# EAGLE schematic NE556-CD4069-Synth-Toy-2 (EAGLE 7.2.0)
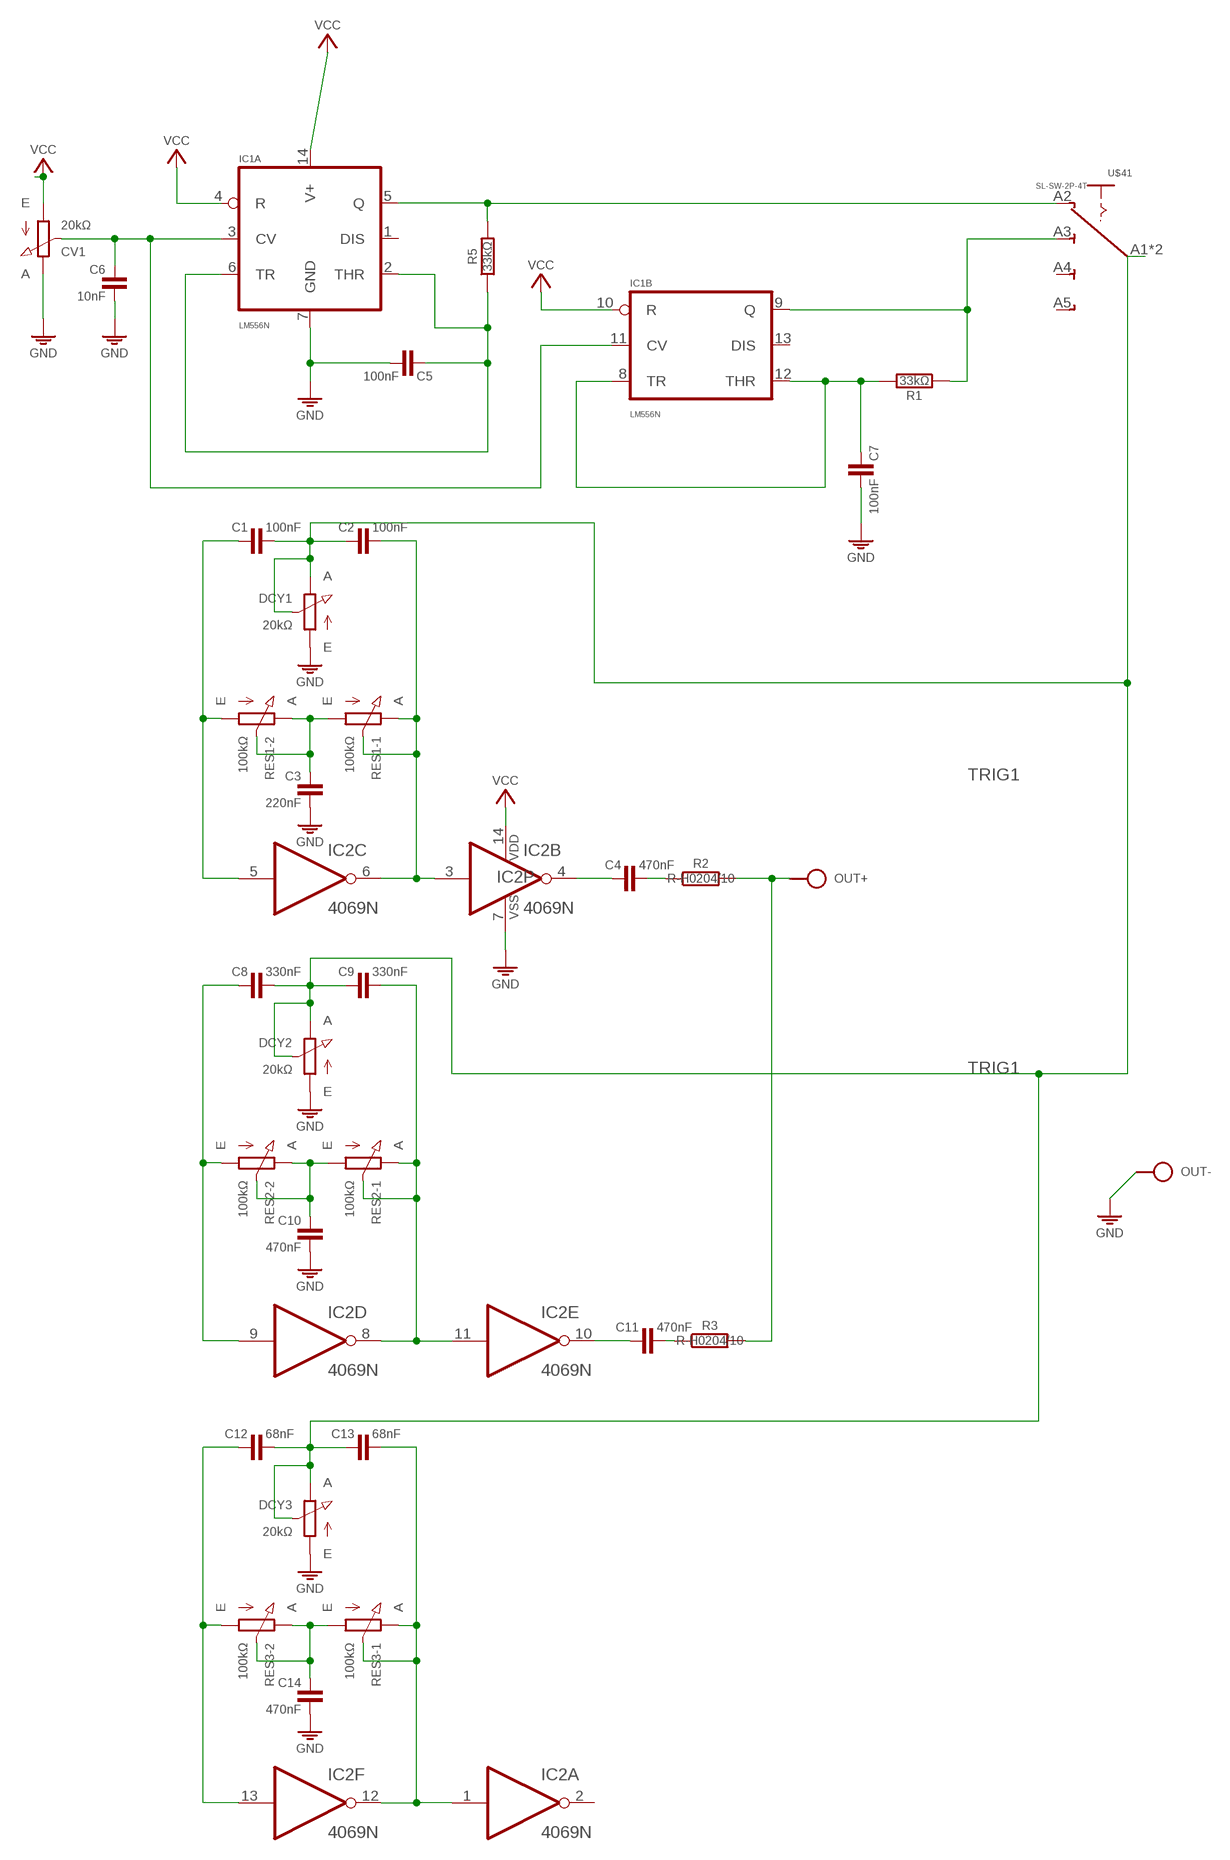
[diagram p0: schematic, sheet 1]

## Parts
C1  100nF  C-H050-024X044  [C050-024X044]
C2  100nF  C-H050-024X044  [C050-024X044]
C3  220nF  C050-020X044/V  [C050-020X044/V]
C4  470nF  C-H050-024X044  [C050-024X044]
C5  100nF  C-H050-020X044  [C050-020X044]
C6  10nF  C050-020X044/V  [C050-020X044/V]
C7  100nF  C-H050-020X044  [C050-020X044]
C8  330nF  C-H050-024X044  [C050-024X044]
C9  330nF  C-H050-024X044  [C050-024X044]
C10  470nF  C050-020X044/V  [C050-020X044/V]
C11  470nF  C-H050-024X044  [C050-024X044]
C12  68nF  C-H050-024X044  [C050-024X044]
C13  68nF  C-H050-024X044  [C050-024X044]
C14  470nF  C050-020X044/V  [C050-020X044/V]
CV1  20kΩ  POT  [POT]
DCY1  20kΩ  POT  [POT]
DCY2  20kΩ  POT  [POT]
DCY3  20kΩ  POT  [POT]
IC1  LM556N  [DIL14]
IC2  4069N  [DIL14]
OUT  SPAD+-+-  [SPAD+-]
R1  33kΩ  R-H0204/10-V  [0204/10-V]
R2  R-H0204/10  [0204/10]
R3  R-H0204/10  [0204/10]
R5  33kΩ  R-H0204/10-V  [0204/10-V]
RES1  100kΩ  POT-STEREO  [POT-STEREO-2X3]
RES2  100kΩ  POT-STEREO  [POT-STEREO-2X3]
RES3  100kΩ  POT-STEREO-1X6-V  [POT-STEREO-1X6-V]
S3  VCC_GNDPWR-L  [PWR-L]
U$4  SL-SW-2P-4T  [SLSW-2P4T-2-H]

## Nets
GND: C3.2 C5.2 C6.2 C7.2 C10.2 C14.2 CV1.E DCY1.A DCY2.A DCY3.A IC1.7(A:GND) IC2.7(P:VSS) OUT.1 S3.1
N$1: C2.2 IC2.3(B:I) IC2.6(C:O) RES1.1-E(-1:E) RES1.1-S(-1:S)
N$2: IC1.5(A:Q) R5.2 U$4.A2(1:A)
N$3: C4.2 R2.1
N$4: C3.1 RES1.1-A(-1:A) RES1.2-E(-2:E) RES1.2-S(-2:S)
N$5: C14.1 RES3.1A(-1:A) RES3.2E(-2:E) RES3.2S(-2:S)
N$6: C4.1 IC2.4(B:O)
N$7: C1.1 IC2.5(C:I) RES1.2-A(-2:A)
N$8: C5.1 IC1.2(A:THR) IC1.6(A:TR) R5.1
N$9: C6.1 CV1.S IC1.3(A:CV) IC1.11(B:CV)
N$10: C12.1 IC2.13(F:I) RES3.2A(-2:A)
N$11: IC1.9(B:Q) R1.1 U$4.A3(1:B)
N$12: C7.1 IC1.8(B:TR) IC1.12(B:THR) R1.2
N$13: C10.1 RES2.1-A(-1:A) RES2.2-E(-2:E) RES2.2-S(-2:S)
N$14: C8.1 IC2.9(D:I) RES2.2-A(-2:A)
N$15: C13.2 IC2.1(A:I) IC2.12(F:O) RES3.1E(-1:E) RES3.1S(-1:S)
N$17: C11.2 R3.1
N$18: C11.1 IC2.10(E:O)
N$19: OUT.2 R2.2 R3.2
N$20: C9.2 IC2.8(D:O) IC2.11(E:I) RES2.1-E(-1:E) RES2.1-S(-1:S)
TRIG1: C1.2 C2.1 C8.2 C9.1 C12.2 C13.1 DCY1.E DCY1.S DCY2.E DCY2.S DCY3.E DCY3.S U$4.A1(1:P) U$4.A6(1:P)
VCC: CV1.A IC1.4(A:R) IC1.10(B:R) IC1.14(A:V+) IC2.14(P:VDD) S3.2
Unconnected: IC1.1(A:DIS) IC1.13(B:DIS) IC2.2(A:O) U$4.A4(1:C) U$4.A5(1:D) U$4.B1(2:P) U$4.B2(2:A) U$4.B3(2:B) U$4.B4(2:C) U$4.B5(2:D) U$4.B6(2:P)

## Library data of the parts
C1 C2 C4 C5 C7-C9 C11-C13 = c:C-H
C3 C6 C10 C14 = c:C: CAPACITOR, European symbol
CV1 DCY1-DCY3 = r:POT
IC1 = ic:*556: Dual Timer http://www.ti.com/lit/ds/symlink/lm556.pdf
IC2 = ic:4069: Hex INVERTER
OUT = pad:SPAD+-
R1-R3 R5 = r:R-H
RES1-RES3 = r:POT-STEREO
S3 = pad:VCC_GND
U$4 = sw:SL-SW-2P-4T